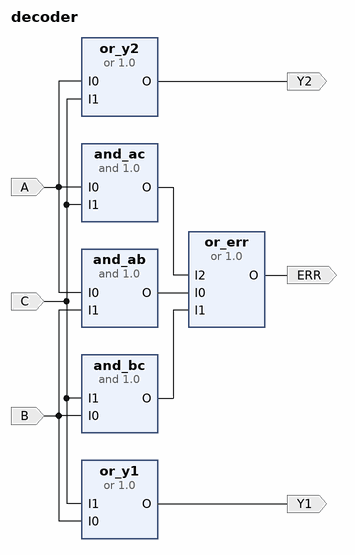
[diagram p0: block diagram of the top level]
# Vivado block design decoder, xc7a35tcpg236-1, Vivado 2018.3
create_bd_design decoder

create_bd_port -dir I A
create_bd_port -dir I B
create_bd_port -dir I C
create_bd_port -dir O -type data Y1
create_bd_port -dir O -type data Y2
create_bd_port -dir O -type data ERR

create_bd_cell -type ip -vlnv FIT:user:or:1.0 or_y1
create_bd_cell -type ip -vlnv FIT:user:or:1.0 or_y2
create_bd_cell -type ip -vlnv FIT:user:or:1.0 or_err
set_property -dict {CONFIG.Inputs 3} [get_bd_cells or_err]
create_bd_cell -type ip -vlnv FIT:user:and:1.0 and_ab
create_bd_cell -type ip -vlnv FIT:user:and:1.0 and_bc
create_bd_cell -type ip -vlnv FIT:user:and:1.0 and_ac

# ---- connections ----

connect_bd_net [get_bd_ports B] [get_bd_pins or_y1/I0] [get_bd_pins and_ab/I1] [get_bd_pins and_bc/I0]
connect_bd_net [get_bd_ports C] [get_bd_pins or_y1/I1] [get_bd_pins or_y2/I1] [get_bd_pins and_bc/I1] [get_bd_pins and_ac/I1]
connect_bd_net [get_bd_ports A] [get_bd_pins or_y2/I0] [get_bd_pins and_ab/I0] [get_bd_pins and_ac/I0]
connect_bd_net [get_bd_pins and_ab/O] [get_bd_pins or_err/I0]
connect_bd_net [get_bd_pins and_bc/O] [get_bd_pins or_err/I1]
connect_bd_net [get_bd_pins and_ac/O] [get_bd_pins or_err/I2]
connect_bd_net [get_bd_pins or_y1/O] [get_bd_ports Y1]
connect_bd_net [get_bd_pins or_y2/O] [get_bd_ports Y2]
connect_bd_net [get_bd_pins or_err/O] [get_bd_ports ERR]

validate_bd_design
save_bd_design
